# Altium schematic sheet SN74LVC1G80DCKR.schdoc
size 53 x 35 mm
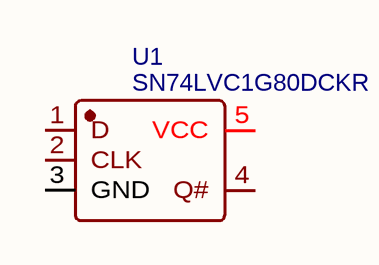
[diagram p0: SN74LVC1G80DCKR.schdoc]

## Parts
U1  SN74LVC1G80DCKR  [SC-70-5_L2.1-W1.3-P0.65-LS2.1-BL]

## Nets

Not connected (* = marked no-connect by the designer): U1 1(D) 2(CLK) 3(GND) 4(Q#) 5(VCC)

## Library data of the parts
U1 = SN74LVC1G80DCKR: BOM_Manufacturer: Texas Instruments; Contributor: LCSC; BOM_Supplier: LCSC; BOM_Supplier Part: C473331; BOM_Manufacturer Part: SN74LVC1G80DCKR; BOM_JLCPCB Part Class: Extended Part; spicePre: U; spiceSymbolName: SN74LVC1G80DCKR